# EAGLE design feather_wing (EAGLE 7.7.0)
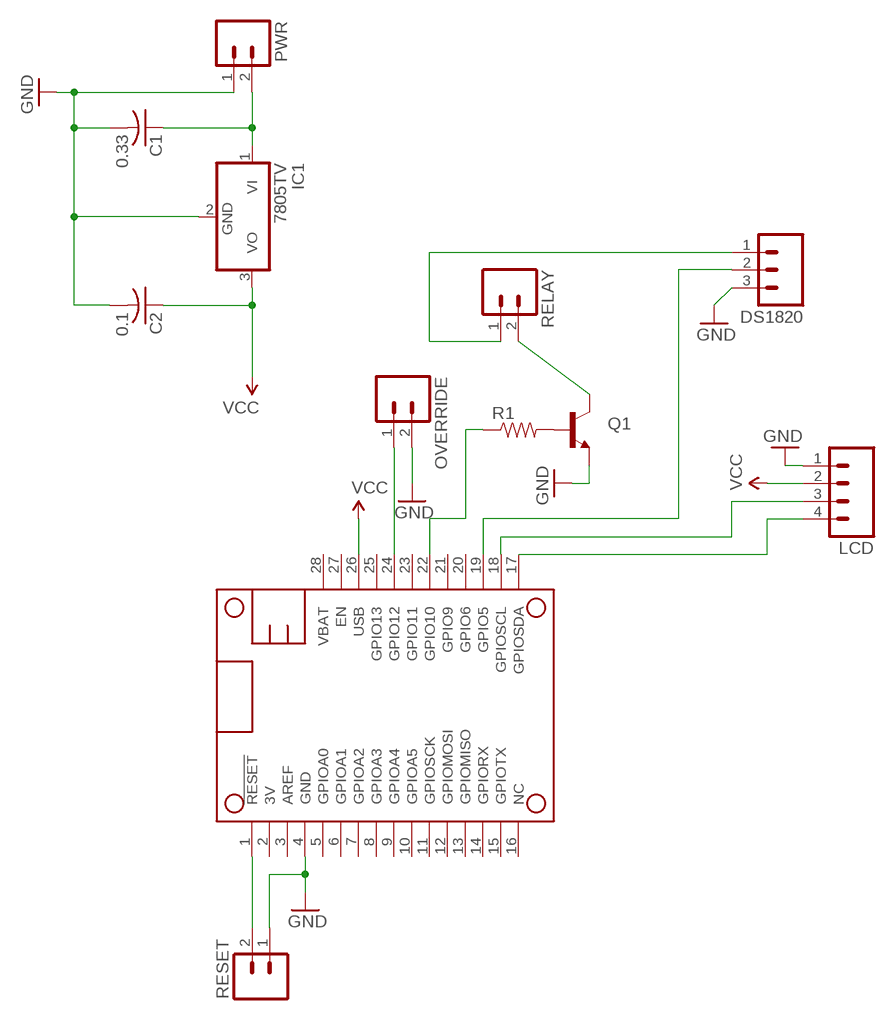
[diagram p0: schematic, sheet 1]

## Parts
C1  0.33  C-US025-025X050  [C025-025X050]
C2  0.1  C-US025-025X050  [C025-025X050]
DS1820  M03SCREW  [SCREWTERMINAL-3.5MM-3]
IC1  7805TV  [TO220V]
LCD  M04LOCK  [1X04_LOCK]
MS1  FEATHERWING  [FEATHERWING]
OVERRIDE  M02PTH  [1X02]
PWR  M023.5MM  [SCREWTERMINAL-3.5MM-2]
Q1  TRANSISTOR_NPNP2N2222A  [TO-92]
R1  RESISTORAXIAL-0.3  [AXIAL-0.3]
RELAY  M023.5MM  [SCREWTERMINAL-3.5MM-2]
RESET  M02PTH  [1X02]

## Nets
GND: C1.2 C2.2 DS1820.3 IC1.2(GND) LCD.1 MS1.4(GND) OVERRIDE.2 PWR.1 Q1.3(E) RESET.1
N$1: C1.1 IC1.1(VI) PWR.2
N$2: DS1820.2 MS1.19(GPIO5)
N$3: MS1.24(GPIO12) OVERRIDE.1
N$4: Q1.1(C) RELAY.2
N$5: Q1.2(B) R1.P$2
N$6: MS1.22(GPIO10) R1.P$1
N$7: LCD.3 MS1.18(GPIOSCL)
N$8: LCD.4 MS1.17(GPIOSDA)
N$9: MS1.1(!RESET) RESET.2
N$10: DS1820.1 RELAY.1
VCC: C2.1 IC1.3(VO) LCD.2 MS1.26(USB)
Unconnected: MS1.2(3V) MS1.3(AREF) MS1.5(GPIOA0) MS1.6(GPIOA1) MS1.7(GPIOA2) MS1.8(GPIOA3) MS1.9(GPIOA4) MS1.10(GPIOA5) MS1.11(GPIOSCK) MS1.12(GPIOMOSI) MS1.13(GPIOMISO) MS1.14(GPIORX) MS1.15(GPIOTX) MS1.16(NC) MS1.20(GPIO6) MS1.21(GPIO9) MS1.23(GPIO11) MS1.25(GPIO13) MS1.27(EN) MS1.28(VBAT)

## Library data of the parts
C1 C2 = adafruit:C-US: CAPACITOR, American symbol
DS1820 = SparkFun-Connectors:M03: Header 3 Standard 3-pin 0.1" header. Use with straight break away headers (SKU : PRT-00116), right angle break away headers (PRT-00553), swiss pins (PRT-00743), machine pins (PRT-00117), and female headers (PRT-00115). Molex polarized connector foot print use with SKU : PRT-08232 with associated crimp pins and housings.; PROD_ID: CONN-08288
IC1 = linear:78*: Positive VOLTAGE REGULATOR Source: http://cache.national.com/ds/LM/LM78L05.pdf http://www.fairchildsemi.com/ds/LM/LM7805.pdf
LCD = SparkFun-Connectors:M04: Header 4 Standard 4-pin 0.1" header. Use with straight break away headers (SKU : PRT-00116), right angle break away headers (PRT-00553), swiss pins (PRT-00743), machine pins (PRT-00117), and female headers (PRT-00115). Molex polarized connector foot print use with SKU : PRT-08231 with associated crimp pins and housings. 1MM SMD Version SKU: PRT-10208; PROD_ID: CONN-09696
MS1 = adafruit:FEATHERWING
OVERRIDE RESET = SparkFun-Connectors:M02: Standard 2-pin 0.1" header. Use with - straight break away headers ( PRT-00116) - right angle break away headers (PRT-00553) - swiss pins (PRT-00743) - machine pins (PRT-00117) - female headers (PRT-00115) Molex polarized connector foot print use with: PRT-08233 with associated crimp pins and housings. 2.54_SCREWTERM for use with PRT-10571. 3.5mm Screw Terminal footprints for PRT-08084 5mm Screw Terminal footprints for use with PRT-08432
PWR RELAY = SparkFun-Connectors:M02: Standard 2-pin 0.1" header. Use with - straight break away headers ( PRT-00116) - right angle break away headers (PRT-00553) - swiss pins (PRT-00743) - machine pins (PRT-00117) - female headers (PRT-00115) Molex polarized connector foot print use with: PRT-08233 with associated crimp pins and housings. 2.54_SCREWTERM for use with PRT-10571. 3.5mm Screw Terminal footprints for PRT-08084 5mm Screw Terminal footprints for use with PRT-08432; PROD_ID: CONN-08399
Q1 = SparkFun-DiscreteSemi:TRANSISTOR_NPN: Generic NPN BJT MMBT2222A - TRANS-08049 (SOT-23, 1A 40V) MPSA42 - TRANS-09116 (SOT-23, 500mA 300V) MMBT5088LT1G - TRANS-11160 (SOT-23, 50 mA 30V) BC547 - COM-08928 <http://www.sparkfun.com/products/8928> (TO-92 45V 100mA) (1.Collector 2.Base 3.Emitter) 2N3904 - COM-00521 <http://www.sparkfun.com/products/521> (TO-92 40V 200mA) (1.Emitter 2.Base 3.Collector) P2N2222A - COM-12852 <http://www.sparkfun.com/products/12852> (TO-92 40V 600mA) (1.Collector 2.Base 3.Emitter); PROD_ID: TRANS-09536
R1 = SparkFun-Passives:RESISTOR: Resistor Basic schematic elements and footprints for 0603, 1206, and PTH resistors.

## Board
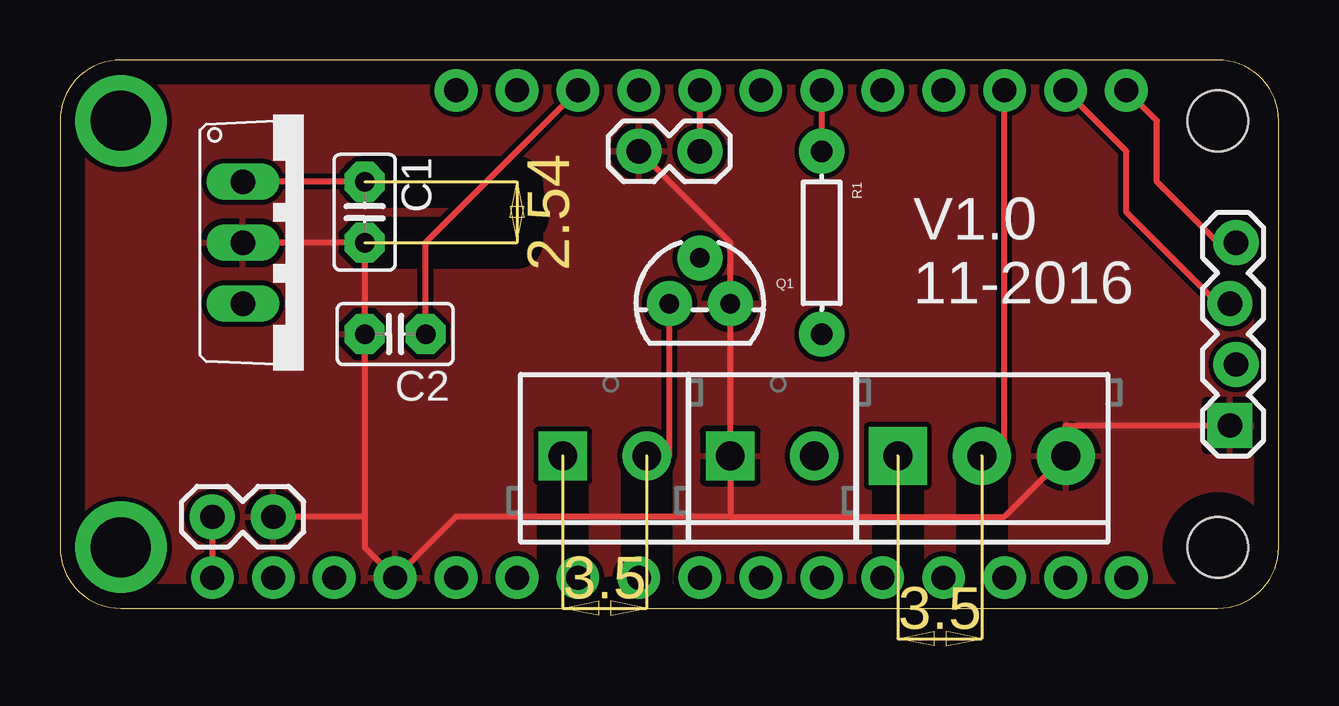
[diagram p1: board, top side]
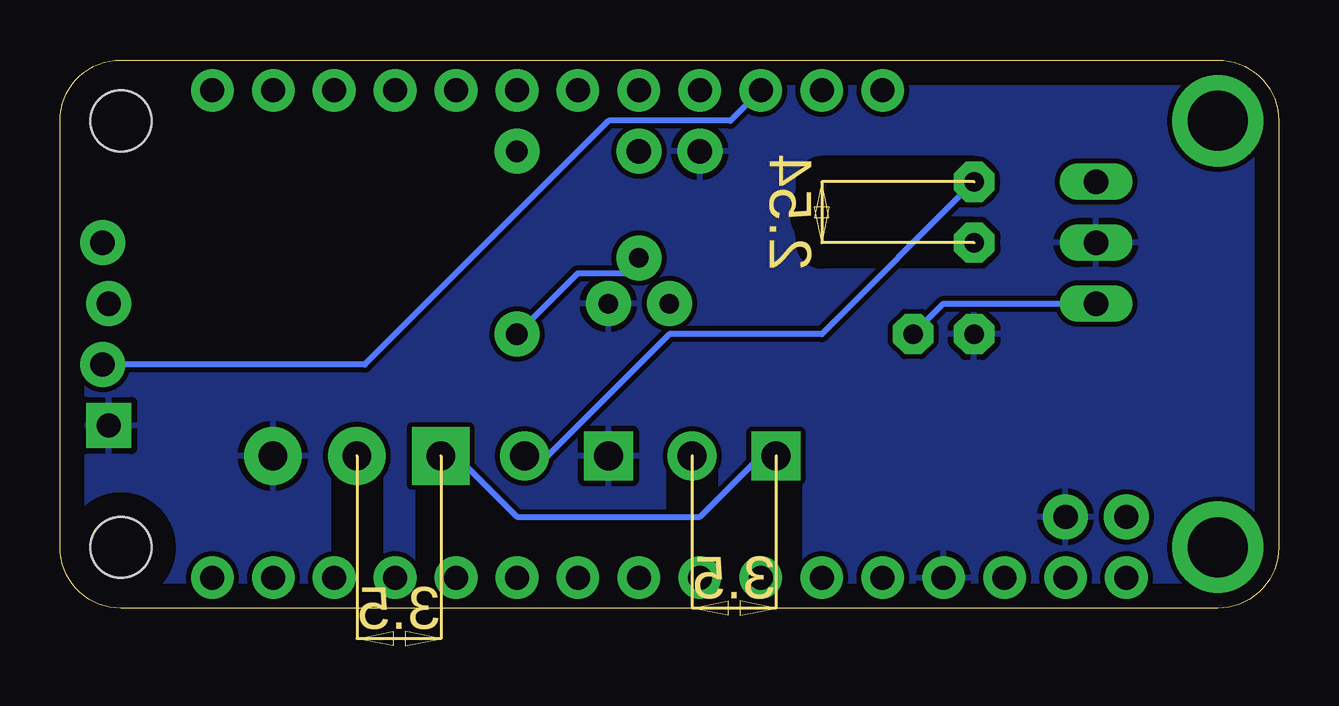
[diagram p2: board, bottom side, seen from below]

Size 50.8 x 22.86 mm. Coordinates in mm from the lower left corner, seen from the top.
Copper layers (1*16): Top 0.035mm / dielectric 1.5mm / Bottom 0.035mm
Design rules "default": minimum track width 10mil, minimum drill 24mil, track to track 8mil, track to pad 8mil, pad to pad 8mil, via to via 8mil, smd to smd 8mil, copper to edge 40mil, drill to drill 8mil, minimum pad ring 10mil, minimum via ring 8mil, stop-mask expansion 4mil, vias tented up to drill 0mil, thermal gap 10mil

### Footprints (pad centres in the part's own frame; a part is rotated, then mirrored left to right if it is on the bottom)
C025-025X050 = drill 0.813 pad 1.676 octagon: 1 -1.27,0; 2 1.27,0
SCREWTERMINAL-3.5MM-3 = drill 1.2 pad 2.413 square: 1 0,0 | drill 1.2 pad 2.413: 2 3.5,0; 3 7,0
TO220V = drill 1.016 long: 1 -2.54,-2.54; 2 0,-2.54; 3 2.54,-2.54
1X04_LOCK = drill 1.016 pad 1.88 square: 1 0,0.127 | drill 1.016 pad 1.88: 2 2.54,-0.127; 3 5.08,0.127; 4 7.62,-0.127
FEATHERWING = drill 1 pad 1.778: 1 6.35,1.27; 2 8.89,1.27; 3 11.43,1.27; 4 13.97,1.27; 5 16.51,1.27; 6 19.05,1.27; 7 21.59,1.27; 8 24.13,1.27; 9 26.67,1.27; 10 29.21,1.27; 11 31.75,1.27; 12 34.29,1.27; 13 36.83,1.27; 14 39.37,1.27; 15 41.91,1.27; 16 44.45,1.27; 17 44.45,21.59; 18 41.91,21.59; 19 39.37,21.59; 20 36.83,21.59; 21 34.29,21.59; 22 31.75,21.59; 23 29.21,21.59; 24 26.67,21.59; 25 24.13,21.59; 26 21.59,21.59; 27 19.05,21.59; 28 16.51,21.59 | drill 2.5 pad 3.81: P$1 2.54,20.32; P$2 2.54,2.54 | hole 2.54: 48.26,20.32; 48.26,2.54
1X02 = drill 1.016 pad 1.88: 1 0,0; 2 2.54,0
SCREWTERMINAL-3.5MM-2 = drill 1.2 pad 2.032 square: 1 0,0 | drill 1.2 pad 2.032: 2 3.5,0
TO-92 = drill 0.813 pad 1.88: 1 -1.27,0; 2 0,1.905; 3 1.27,0
AXIAL-0.3 = drill 0.9 pad 1.88: P$1 -3.81,0; P$2 3.81,0

### Placement (x,y rotation side)
C1  12.7,16.51 270 top
C2  13.97,11.43 180 top
DS1820  34.92,6.35 0 top
IC1  10.16,15.24 270 top
LCD  48.9,7.62 90 top
MS1  0,0 0 top
OVERRIDE  26.67,19.05 180 top
PWR  27.94,6.35 0 top
Q1  26.67,12.7 0 top
R1  31.75,15.24 270 top
RELAY  20.95,6.35 0 top
RESET  8.89,3.81 180 top

### Tracks (layer width: path | path; a pad name or v marks a point on that pad's centre or on a via)
GND
  Top 0.254: IC1.2 C1.2 C2.2 12.7,3.81 | 12.7,3.81 12.7,2.54 MS1.4 16.51,3.81 27.94,3.81 | 12.7,3.81 RESET.1 | LCD.1 41.91,7.62 DS1820.3 | OVERRIDE.2 27.94,15.24 Q1.3 PWR.1 27.94,3.81 | DS1820.3 39.37,3.81 27.94,3.81 | DS1820.3
  pour Top: 0,0 0,22.86 50.8,22.86 50.8,0
  pour Bottom: 0,0 0,22.86 50.8,22.86 50.8,0
N$1
  Top 0.254: C1.1 IC1.1
  Bottom 0.254: C1.1 19.05,11.43 25.4,11.43 30.48,6.35 PWR.2
N$2
  Top 0.254: MS1.19 39.37,6.35 DS1820.2
N$3
  Top 0.254: OVERRIDE.1 MS1.24
N$4
  Top 0.254: Q1.1 25.4,6.35 RELAY.2
N$5
  Bottom 0.254: R1.P$2 29.21,13.97 26.67,13.97 Q1.2
N$6
  Top 0.254: R1.P$1 MS1.22
N$7
  Top 0.254: MS1.18 44.45,19.05 44.45,16.51 48.26,12.7 LCD.3
N$8
  Top 0.254: MS1.17 45.72,20.32 45.72,17.78 48.26,15.24 LCD.4
N$9
  Top 0.254: RESET.2 MS1.1
N$10
  Bottom 0.254: RELAY.1 21.59,6.35 24.13,3.81 31.75,3.81 34.29,6.35 DS1820.1
VCC
  Top 0.254: MS1.26 15.24,15.24 C2.1
  Bottom 0.254: IC1.3 13.97,12.7 C2.1 | LCD.2 38.1,10.16 27.94,20.32 22.86,20.32 MS1.26

### Text on the board
tPlace: V1.0 / 11-2016